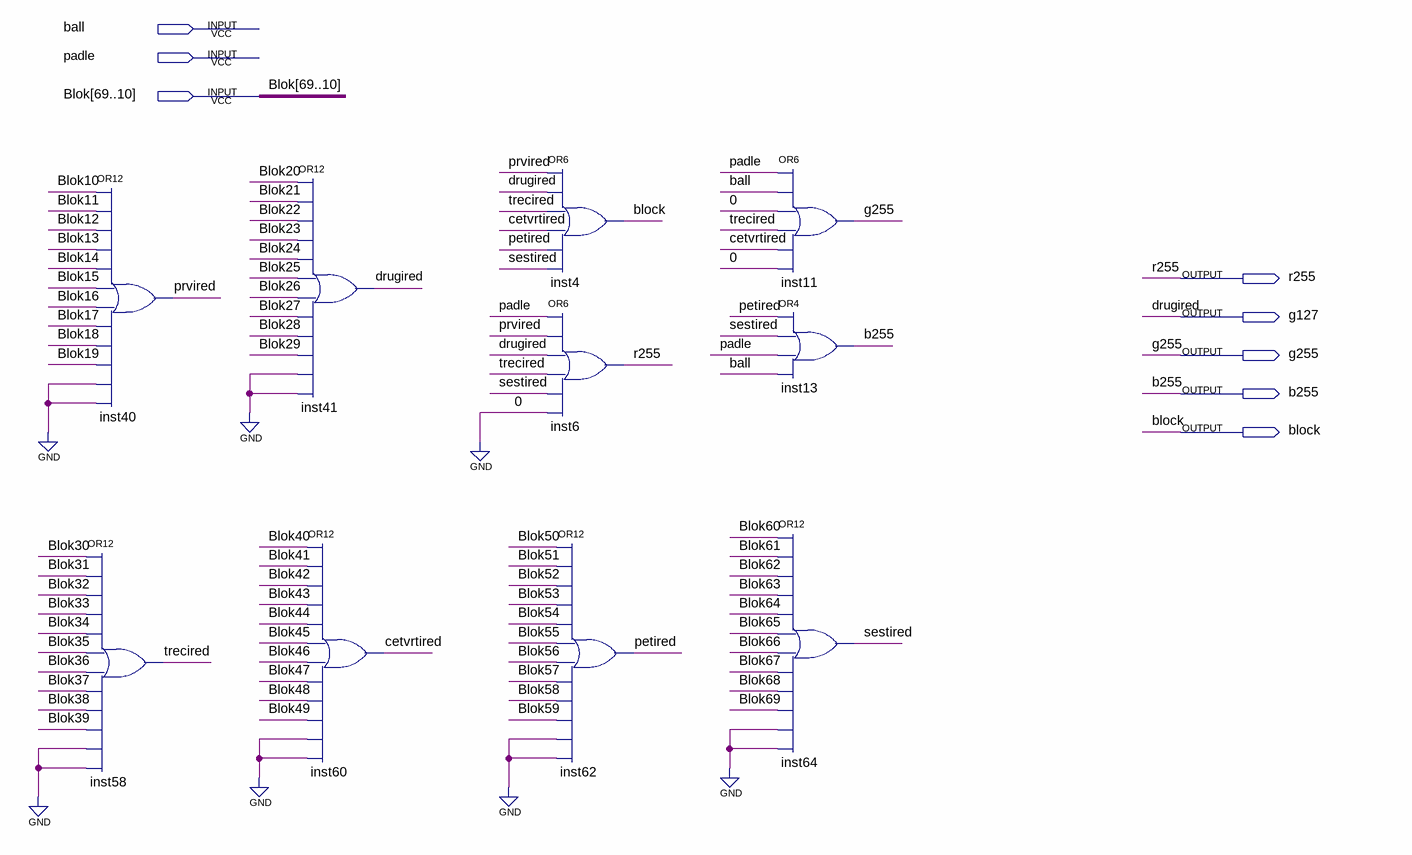
[diagram p0: schematic sheet]
// Quartus schematic BojeBlokovi.bdf as structural Verilog: 10 symbols, 8 pins
module BojeBlokovi (
  input  ball,
  input  padle,
  input  [69:10] Blok,
  output r255,
  output g127,
  output g255,
  output b255,
  output block
);

  wire cetvrtired, petired, prvired, sestired, trecired;

  or inst40 (prvired, Blok[10], Blok[11], Blok[12], Blok[13], Blok[14], Blok[15], Blok[16], Blok[17], Blok[18], Blok[19], 1'b0, 1'b0);
  or inst58 (trecired, Blok[30], Blok[31], Blok[32], Blok[33], Blok[34], Blok[35], Blok[36], Blok[37], Blok[38], Blok[39], 1'b0, 1'b0);
  or inst41 (g127, Blok[20], Blok[21], Blok[22], Blok[23], Blok[24], Blok[25], Blok[26], Blok[27], Blok[28], Blok[29], 1'b0, 1'b0);
  or inst60 (cetvrtired, Blok[40], Blok[41], Blok[42], Blok[43], Blok[44], Blok[45], Blok[46], Blok[47], Blok[48], Blok[49], 1'b0, 1'b0);
  or inst4 (block, prvired, g127, trecired, cetvrtired, petired, sestired);
  or inst6 (r255, padle, prvired, g127, trecired, sestired, 1'b0);
  or inst62 (petired, Blok[50], Blok[51], Blok[52], Blok[53], Blok[54], Blok[55], Blok[56], Blok[57], Blok[58], Blok[59], 1'b0, 1'b0);
  or inst11 (g255, padle, ball, 1'b0, trecired, cetvrtired, 1'b0);
  or inst13 (b255, petired, sestired, padle, ball);
  or inst64 (sestired, Blok[60], Blok[61], Blok[62], Blok[63], Blok[64], Blok[65], Blok[66], Blok[67], Blok[68], Blok[69], 1'b0, 1'b0);

  // Other names for the same wires on the sheet: drugired = g127
endmodule
